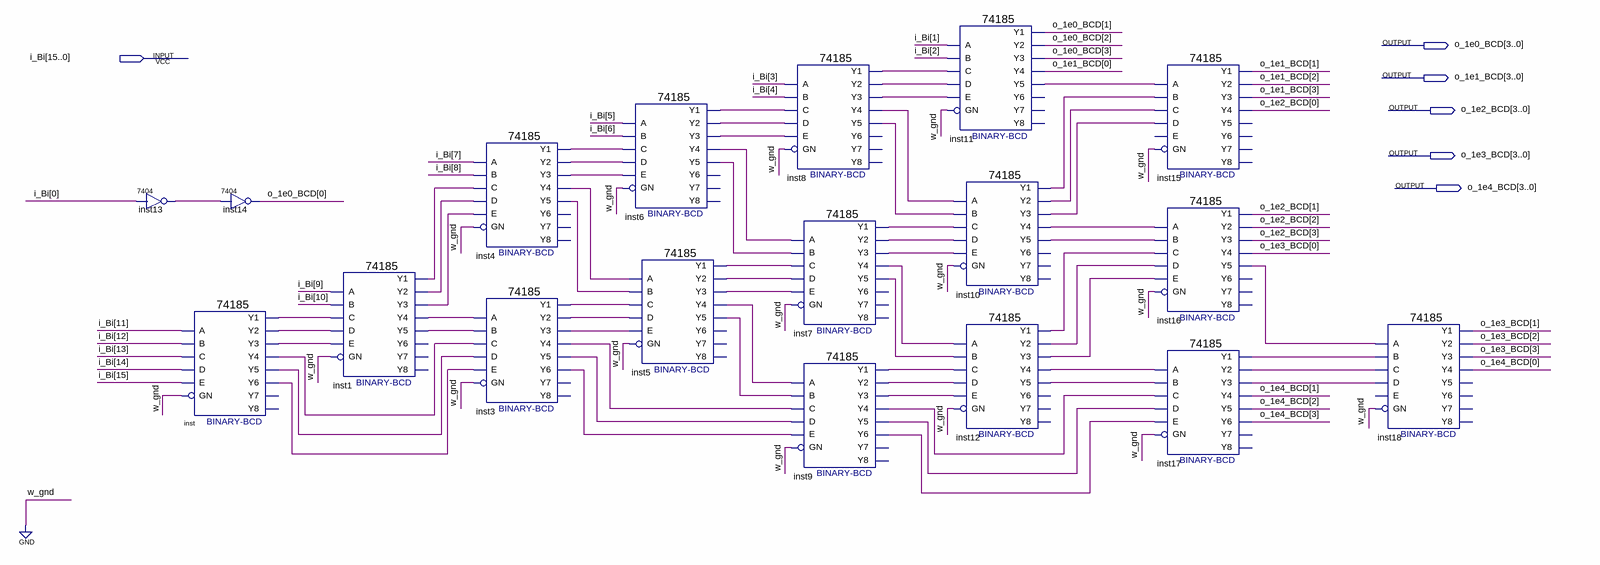
[diagram p0: schematic sheet]
// Quartus schematic binary_to_bcd_converter_16bits.bdf as structural Verilog: 18 symbols, 6 pins
module binary_to_bcd_converter_16bits (
  input  [15:0] i_Bi,
  output [3:0] o_1e0_BCD,
  output [3:0] o_1e1_BCD,
  output [3:0] o_1e2_BCD,
  output [3:0] o_1e3_BCD,
  output [3:0] o_1e4_BCD
);

  wire inst1_y1, inst1_y2, inst1_y3, inst1_y4, inst1_y5, inst3_y1, inst3_y2, inst3_y3, inst3_y4, inst3_y5,
       inst3_y6, inst4_y1, inst4_y2, inst4_y3, inst4_y4, inst4_y5, inst5_y1, inst5_y2, inst5_y3, inst5_y4,
       inst5_y5, inst6_y1, inst6_y2, inst6_y3, inst6_y4, inst6_y5, inst7_y1, inst7_y2, inst7_y3, inst7_y4,
       inst7_y5, inst8_y1, inst8_y2, inst8_y3, inst8_y4, inst8_y5, inst9_y1, inst9_y2, inst9_y3, inst9_y4,
       inst9_y5, inst9_y6, inst10_y1, inst10_y2, inst10_y3, inst10_y4, inst10_y5, inst11_y5, inst12_y1,
       inst12_y2, inst12_y3, inst12_y4, inst12_y5, inst13_1, inst16_y5, inst17_y1, inst17_y2, inst17_y3,
       inst_y1, inst_y2, inst_y3, inst_y4, inst_y5, inst_y6;

  \7404  inst13 (.\2 (i_Bi[0]), .\1 (inst13_1));
  \74185  inst (
    .A(i_Bi[11]), .B(i_Bi[12]), .D(i_Bi[14]), .C(i_Bi[13]), .E(i_Bi[15]), .GN(1'b0), .Y1(inst_y1),
    .Y3(inst_y3), .Y2(inst_y2), .Y5(inst_y5), .Y4(inst_y4), .Y6(inst_y6));  // open: Y8, Y7
  \7404  inst14 (.\2 (inst13_1), .\1 (o_1e0_BCD[0]));
  \74185  inst1 (
    .A(i_Bi[9]), .B(i_Bi[10]), .D(inst_y2), .C(inst_y1), .E(inst_y3), .GN(1'b0), .Y1(inst1_y1),
    .Y3(inst1_y3), .Y2(inst1_y2), .Y5(inst1_y5), .Y4(inst1_y4));  // open: Y6, Y8, Y7
  \74185  inst4 (
    .A(i_Bi[7]), .B(i_Bi[8]), .D(inst1_y2), .C(inst1_y1), .E(inst1_y3), .GN(1'b0), .Y1(inst4_y1),
    .Y3(inst4_y3), .Y2(inst4_y2), .Y5(inst4_y5), .Y4(inst4_y4));  // open: Y6, Y8, Y7
  \74185  inst3 (
    .A(inst1_y4), .B(inst1_y5), .D(inst_y5), .C(inst_y4), .E(inst_y6), .GN(1'b0), .Y1(inst3_y1),
    .Y3(inst3_y3), .Y2(inst3_y2), .Y5(inst3_y5), .Y4(inst3_y4), .Y6(inst3_y6));  // open: Y8, Y7
  \74185  inst6 (
    .A(i_Bi[5]), .B(i_Bi[6]), .D(inst4_y2), .C(inst4_y1), .E(inst4_y3), .GN(1'b0), .Y1(inst6_y1),
    .Y3(inst6_y3), .Y2(inst6_y2), .Y5(inst6_y5), .Y4(inst6_y4));  // open: Y6, Y8, Y7
  \74185  inst5 (
    .A(inst4_y4), .B(inst4_y5), .D(inst3_y2), .C(inst3_y1), .E(inst3_y3), .GN(1'b0), .Y1(inst5_y1),
    .Y3(inst5_y3), .Y2(inst5_y2), .Y5(inst5_y5), .Y4(inst5_y4));  // open: Y6, Y8, Y7
  \74185  inst8 (
    .A(i_Bi[3]), .B(i_Bi[4]), .D(inst6_y2), .C(inst6_y1), .E(inst6_y3), .GN(1'b0), .Y1(inst8_y1),
    .Y3(inst8_y3), .Y2(inst8_y2), .Y5(inst8_y5), .Y4(inst8_y4));  // open: Y6, Y8, Y7
  \74185  inst7 (
    .A(inst6_y4), .B(inst6_y5), .D(inst5_y2), .C(inst5_y1), .E(inst5_y3), .GN(1'b0), .Y1(inst7_y1),
    .Y3(inst7_y3), .Y2(inst7_y2), .Y5(inst7_y5), .Y4(inst7_y4));  // open: Y6, Y8, Y7
  \74185  inst9 (
    .A(inst5_y4), .B(inst5_y5), .D(inst3_y5), .C(inst3_y4), .E(inst3_y6), .GN(1'b0), .Y1(inst9_y1),
    .Y3(inst9_y3), .Y2(inst9_y2), .Y5(inst9_y5), .Y4(inst9_y4), .Y6(inst9_y6));  // open: Y8, Y7
  \74185  inst11 (
    .A(i_Bi[1]), .B(i_Bi[2]), .D(inst8_y2), .C(inst8_y1), .E(inst8_y3), .GN(1'b0), .Y1(o_1e0_BCD[1]),
    .Y3(o_1e0_BCD[3]), .Y2(o_1e0_BCD[2]), .Y5(inst11_y5), .Y4(o_1e1_BCD[0]));  // open: Y6, Y8, Y7
  \74185  inst10 (
    .A(inst8_y4), .B(inst8_y5), .D(inst7_y2), .C(inst7_y1), .E(inst7_y3), .GN(1'b0), .Y1(inst10_y1),
    .Y3(inst10_y3), .Y2(inst10_y2), .Y5(inst10_y5), .Y4(inst10_y4));  // open: Y6, Y8, Y7
  \74185  inst12 (
    .A(inst7_y4), .B(inst7_y5), .D(inst9_y2), .C(inst9_y1), .E(inst9_y3), .GN(1'b0), .Y1(inst12_y1),
    .Y3(inst12_y3), .Y2(inst12_y2), .Y5(inst12_y5), .Y4(inst12_y4));  // open: Y6, Y8, Y7
  \74185  inst15 (
    .A(inst11_y5), .B(inst10_y1), .D(inst10_y3), .C(inst10_y2), .GN(1'b0), .Y1(o_1e1_BCD[1]),
    .Y3(o_1e1_BCD[3]), .Y2(o_1e1_BCD[2]), .Y4(o_1e2_BCD[0]));  // open: E, Y5, Y6, Y8, Y7
  \74185  inst16 (
    .A(inst10_y4), .B(inst10_y5), .D(inst12_y2), .C(inst12_y1), .E(inst12_y3), .GN(1'b0), .Y1(o_1e2_BCD[1]),
    .Y3(o_1e2_BCD[3]), .Y2(o_1e2_BCD[2]), .Y5(inst16_y5), .Y4(o_1e3_BCD[0]));  // open: Y6, Y8, Y7
  \74185  inst17 (
    .A(inst12_y4), .B(inst12_y5), .D(inst9_y5), .C(inst9_y4), .E(inst9_y6), .GN(1'b0), .Y1(inst17_y1),
    .Y3(inst17_y3), .Y2(inst17_y2), .Y5(o_1e4_BCD[2]), .Y4(o_1e4_BCD[1]), .Y6(o_1e4_BCD[3]));  // open: Y8, Y7
  \74185  inst18 (
    .A(inst16_y5), .B(inst17_y1), .D(inst17_y3), .C(inst17_y2), .GN(1'b0), .Y1(o_1e3_BCD[1]),
    .Y3(o_1e3_BCD[3]), .Y2(o_1e3_BCD[2]), .Y4(o_1e4_BCD[0]));  // open: E, Y5, Y6, Y8, Y7
endmodule
